# EasyEDA schematic RP2040.json
TITLE: RP2040 Minimal Design for JLCPCB; REV: 1.0; Date: 2023-03-28; Sheet: 1/1; Drawn By: Jeff Rebeiro; Company: ACustomArcade
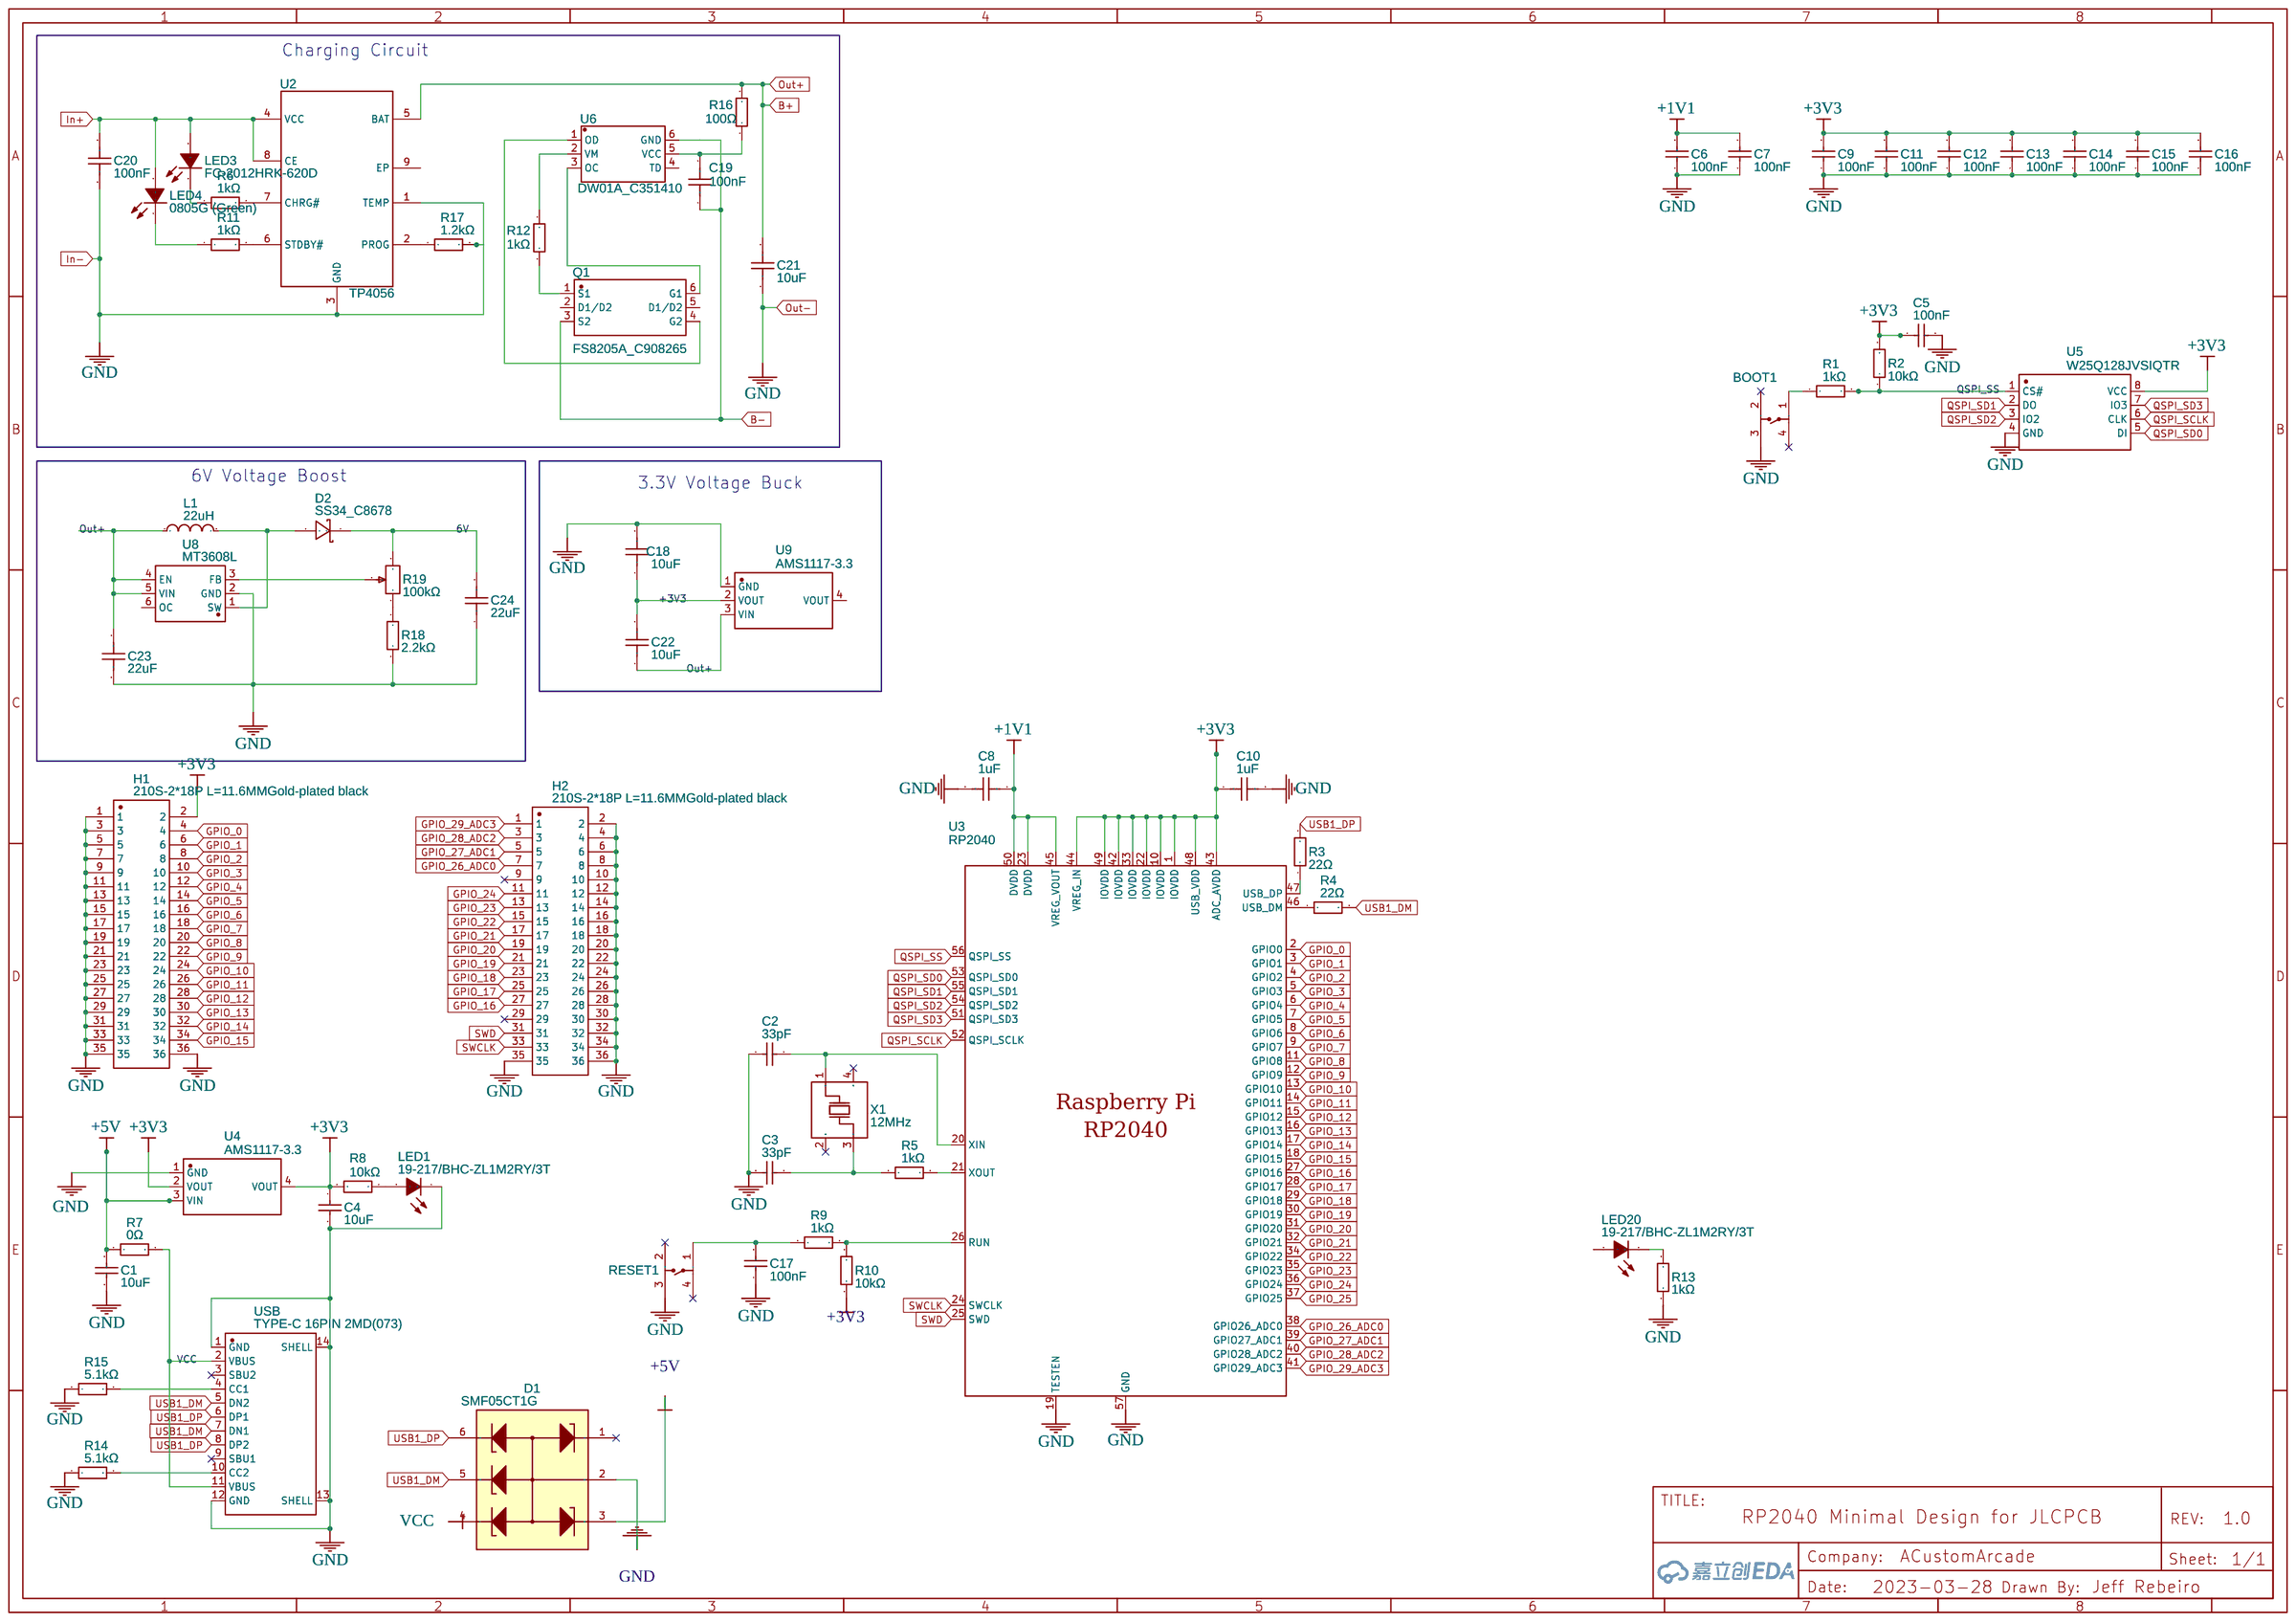
[diagram p0: schematic sheet]

## Parts
BOOT1  TD-1182SA-2.0H-250  [SW-SMD_4P-L3.5-W3.0-P1.50-LS4.6_DEALON_TD-1182SA-2.0H-250]
C1  10uF  [C1206]
C2  33pF  [C0402]
C3  33pF  [C0402]
C4  10uF  [C1206]
C5  100nF  [C0402_NEW]
C6  100nF  [C0402_NEW]
C7  100nF  [C0402_NEW]
C8  1uF  [C0402]
C9  100nF  [C0402_NEW]
C10  1uF  [C0402]
C11  100nF  [C0402_NEW]
C12  100nF  [C0402_NEW]
C13  100nF  [C0402_NEW]
C14  100nF  [C0402_NEW]
C15  100nF  [C0402_NEW]
C16  100nF  [C0402_NEW]
C17  100nF  [C0402_NEW]
C18  10uF  [C0603]
C19  100nF  [C0603]
C20  100nF  [C0603]
C21  10uF  [C0603]
C22  10uF  [C0603]
C23  22uF  [C0603]
C24  22uF  [C0603]
D1  SMF05CT1G  [SOT-363_L2.0-W1.3-P0.65-LS2.1-TL]
D2  SS34_C8678  [SMA_L4.3-W2.6-LS5.2-RD]
H1  210S-2*18P L=11.6MMGold-plated black  [HDR-TH_36P-P2.54-V-M-R2-C18-S2.54-1]
H2  210S-2*18P L=11.6MMGold-plated black  [HDR-TH_36P-P2.54-V-M-R2-C18-S2.54-1]
L1  22uH  [IND-SMD_L7.0-W6.8]
LED1  19-217/BHC-ZL1M2RY/3T  [LED0603-RD]
LED3  FC-2012HRK-620D  [LED0805-R-RD]
LED4  0805G (Green)  [LED0805-R-RD]
LED20  19-217/BHC-ZL1M2RY/3T  [LED0603-RD]
Q1  FS8205A_C908265  [SOT-23-6_L2.9-W1.6-P0.95-LS2.8-BR]
R1  1kΩ  [R0402]
R2  10kΩ  [R0402]
R3  22Ω  [R0402]
R4  22Ω  [R0402]
R5  1kΩ  [R0402]
R6  1kΩ  [R0805]
R7  0Ω  [R0603]
R8  10kΩ  [R0402]
R9  1kΩ  [R0402]
R10  10kΩ  [R0402]
R11  1kΩ  [R0805]
R12  1kΩ  [R0805]
R13  1kΩ  [R0402]
R14  5.1kΩ  [R0402]
R15  5.1kΩ  [R0402]
R16  100Ω  [R0805]
R17  1.2kΩ  [R0805]
R18  2.2kΩ  [R0805]
R19  100kΩ  [RES-ADJ-SMD_VG039NCH]
RESET1  TD-1182SA-2.0H-250  [SW-SMD_4P-L3.5-W3.0-P1.50-LS4.6_DEALON_TD-1182SA-2.0H-250]
U2  TP4056  [ESOP-8_L4.9-W3.9-P1.27-LS6.0-BL-EP]
U3  RP2040  [LQFN-56_L7.0-W7.0-P0.4-EP]
U4  AMS1117-3.3  [SOT-223-3_L6.5-W3.4-P2.30-LS7.0-BR]
U5  W25Q128JVSIQTR  [SOIC-8_L5.3-W5.3-P1.27-LS8.0-BL]
U6  DW01A_C351410  [SOT-23-6_L2.9-W1.6-P0.95-LS2.8-BL]
U8  MT3608L  [SOT-23-6_L2.9-W1.7-P0.95-LS2.8-BL]
U9  AMS1117-3.3  [SOT-223-3_L6.5-W3.4-P2.30-LS7.0-BR]
USB  TYPE-C 16PIN 2MD(073)  [USB-C-SMD_TYPE-C-6PIN-2MD-073]
X1  12MHz  [OSC-SMD_4P-L3.2-W2.5-BL]

## Library data of the parts
BOOT1 RESET1 = TD-1182SA-2.0H-250: Supplier: LCSC; Supplier Part: C2905178; Manufacturer: DEALON(德艺隆); Contributor: LCSC; JLCPCB Part Class: Extended Part
C1 C4 = CL31A106KBHNNNE: Supplier: LCSC; Manufacturer: SAMSUNG(三星); Supplier Part: C13585; JLCPCB Part Class: Basic Part
C2 C3 = 0402CG330J500NT: Supplier: LCSC; Manufacturer: FH(风华); Supplier Part: C1562; JLCPCB Part Class: Basic Part
C5-C7 C9 C11-C17 = CL05B104KO5NNNC: Supplier: LCSC; Manufacturer: SAMSUNG(三星); Supplier Part: C1525; JLCPCB Part Class: Basic Part
C8 C10 = CL05A105KA5NQNC: Supplier: LCSC; Manufacturer: SAMSUNG(三星); Supplier Part: C52923; JLCPCB Part Class: Basic Part
C18 C21 C22 = CL10A106KP8NNNC: Supplier: LCSC; Manufacturer: SAMSUNG(三星); Supplier Part: C19702; JLCPCB Part Class: Basic Part; link: https://lcsc.com/eda_search?q=C19702&%26type=1&ref=editor
C19 C20 = CC0603KRX7R9BB104: Supplier: LCSC; Manufacturer: YAGEO(国巨); Supplier Part: C14663; JLCPCB Part Class: Basic Part; link: https://lcsc.com/eda_search?q=C14663&%26type=1&ref=editor
C23 C24 = CL10A226MQ8NRNC: Supplier: LCSC; Manufacturer: SAMSUNG(三星); Supplier Part: C59461; JLCPCB Part Class: Basic Part; link: https://lcsc.com/eda_search?q=C59461&%26type=1&ref=editor
D1 = SMF05CT1G: Supplier: LCSC; Manufacturer: onsemi(安森美); Supplier Part: C15879; JLCPCB Part Class: Basic Part
D2 = SS34_C8678: Supplier: LCSC; Manufacturer Part: SS34; Manufacturer: MDD; Supplier Part: C8678; JLCPCB Part Class: Basic Part; link: https://lcsc.com/eda_search?q=C8678&%26type=1&ref=editor
H1 H2 = 210S-2*18P L=11.6MMGold-plated black: Supplier: LCSC; Supplier Part: C168945; Manufacturer: Ckmtw(灿科盟); Manufacturer Part: B-2100S36P-B110; Contributor: LCSC; JLCPCB Part Class: Extended Part
L1 = SMRH74-220MT: Supplier: LCSC; Manufacturer: SXN(顺翔诺); Supplier Part: C27442; JLCPCB Part Class: Extended Part; link: https://lcsc.com/eda_search?q=C27442&%26type=1&ref=editor
LED1 LED20 = 19-217/BHC-ZL1M2RY/3T: Supplier: LCSC; Manufacturer: EVERLIGHT(亿光); Supplier Part: C72041; JLCPCB Part Class: Basic Part
LED3 = FC-2012HRK-620D: Supplier: LCSC; Manufacturer: 国星光电; Manufacturer Part: NCD0805R1; Supplier Part: C84256; JLCPCB Part Class: Basic Part; link: https://lcsc.com/eda_search?q=C84256&%26type=1&ref=editor
LED4 = 0805G (Green): Supplier: LCSC; Manufacturer: KENTO; Manufacturer Part: KT-0805翠绿; Supplier Part: C2297; JLCPCB Part Class: Basic Part; link: https://lcsc.com/eda_search?q=C2297&%26type=1&ref=editor
Q1 = FS8205A_C908265: Contributor: LCSC; JLCPCB Part Class: Extended Part; Supplier: LCSC; Supplier Part: C908265; Manufacturer: FUXINSEMI(富芯森美); Manufacturer Part: FS8205A; link: https://lcsc.com/eda_search?q=C908265&%26type=1&ref=editor
R1 R5 R9 R13 = 0402WGF1001TCE: Supplier: LCSC; Manufacturer: UNI-ROYAL(厚声); Supplier Part: C11702; Resistance (Ohms): 1K; JLCPCB Part Class: Basic Part
R2 R8 R10 = 0402WGF1002TCE: Supplier: LCSC; Manufacturer: UNI-ROYAL(厚声); Supplier Part: C25744; Resistance (Ohms): 10K; JLCPCB Part Class: Basic Part
R3 R4 = 0402WGF220JTCE: Supplier: LCSC; Manufacturer: UNI-ROYAL(厚声); Supplier Part: C25092; Resistance (Ohms): 22; JLCPCB Part Class: Basic Part
R6 R11 R12 = 0805W8F1001T5E: Supplier: LCSC; Manufacturer: UNI-ROYAL(厚声); Supplier Part: C17513; JLCPCB Part Class: Basic Part; link: https://lcsc.com/eda_search?q=C17513&%26type=1&ref=editor
R7 = 0603WAF0000T5E: Supplier: LCSC; Manufacturer: UNI-ROYAL(厚声); Supplier Part: C21189; Resistance (Ohms): 0; JLCPCB Part Class: Basic Part
R14 R15 = 0402WGF5101TCE: Supplier: LCSC; Manufacturer: UNI-ROYAL(厚声); Supplier Part: C25905; Resistance (Ohms): 5.1K; JLCPCB Part Class: Basic Part
R16 = 0805W8F1000T5E: Supplier: LCSC; Manufacturer: UNI-ROYAL(厚声); Supplier Part: C17408; JLCPCB Part Class: Basic Part; link: https://lcsc.com/eda_search?q=C17408&%26type=1&ref=editor
R17 = 0805W8F1201T5E: Supplier: LCSC; Manufacturer: UNI-ROYAL(厚声); Supplier Part: C17379; JLCPCB Part Class: Basic Part; link: https://lcsc.com/eda_search?q=C17379&%26type=1&ref=editor
R18 = 0805W8F2201T5E: Supplier: LCSC; Manufacturer: UNI-ROYAL(厚声); Supplier Part: C17520; JLCPCB Part Class: Basic Part; link: https://lcsc.com/eda_search?q=C17520&%26type=1&ref=editor
R19 = VG039NCHXTB104: Contributor: LCSC; Resistance(Ohms): 100K; Supplier: LCSC; Manufacturer: HDK(北陆电气); Supplier Part: C128545; JLCPCB Part Class: Extended Part; link: https://lcsc.com/eda_search?q=C128545&%26type=1&ref=editor
U2 = TP4056: Contributor: Guest; Supplier: LCSC; Manufacturer: TOPPOWER(南京拓微); Manufacturer Part: TP4056-42-ESOP8; Supplier Part: C16581; JLCPCB Part Class: Basic Part; link: https://lcsc.com/eda_search?q=C16581&%26type=1&ref=editor
U3 = RP2040: Supplier: LCSC; Supplier Part: C2040; Manufacturer: Raspberry Pi(树莓派); JLCPCB Part Class: Extended Part; Contributor: LCSC
U4 U9 = AMS1117-3.3: sourceId: dwIGgezVh; Supplier: LCSC; Manufacturer: AMS; Supplier Part: C6186; JLCPCB Part Class: Basic Part
U5 = W25Q128JVSIQTR: Supplier: LCSC; Manufacturer: WINBOND(华邦); Manufacturer Part: W25Q128JVSIQ; Supplier Part: C97521; JLCPCB Part Class: Basic Part
U6 = DW01A_C351410: Contributor: LCSC; Supplier: LCSC; Supplier Part: C351410; Manufacturer: PUOLOP(迪浦); Manufacturer Part: DW01A; JLCPCB Part Class: Extended Part; link: https://lcsc.com/eda_search?q=C351410&%26type=1&ref=editor
U8 = MT3608L: Contributor: LCSC; Supplier: LCSC; Supplier Part: C2932326; Manufacturer: 西安航天民芯; JLCPCB Part Class: Extended Part; link: https://lcsc.com/eda_search?q=C2932326&%26type=1&ref=editor; Package Display: No
USB = TYPE-C 16PIN 2MD(073): Supplier: LCSC; Supplier Part: C2765186; Manufacturer: SHOU HAN(首韩); Contributor: LCSC; JLCPCB Part Class: Extended Part
X1 = X322512MSB4SI: Supplier: LCSC; Manufacturer: YXC; Supplier Part: C9002; JLCPCB Part Class: Basic Part

## Nets
6V: C24.2 D2.1(K) R19.3
+1V1: C6.2 C7.2 C8.1 U3.23(DVDD) U3.45(VREG_VOUT) U3.50(DVDD)
+3V3: C4.1 C5.2 C9.2 C10.1 C11.2 C12.2 C13.2 C14.2 C15.2 C16.2 C18.1 C22.2 H1.2 R2.2 R8.2 R10.1 U3.1(IOVDD) U3.10(IOVDD) U3.22(IOVDD) U3.33(IOVDD) U3.42(IOVDD) U3.43(ADC_AVDD) U3.44(VREG_IN) U3.48(USB_VDD) U3.49(IOVDD) U4.2(VOUT) U4.4(VOUT) U5.8(VCC) U9.2(VOUT)
+5V: C1.1 D1.3 R7.1 U4.3(VIN)
GND: BOOT1.3 C1.2 C2.1 C3.1 C4.2 C5.1 C6.1 C7.1 C8.2 C9.1 C10.2 C11.1 C12.1 C13.1 C14.1 C15.1 C16.1 C17.1 C18.2 C20.1 C21.1 C23.2 C24.1 D1.2 H1.1 H1.3 H1.5 H1.7 H1.9 H1.11 H1.13 H1.15 H1.17 H1.19 H1.21 H1.23 H1.25 H1.27 H1.29 H1.31 H1.33 H1.35 H1.36 H2.2 H2.4 H2.6 H2.8 H2.10 H2.12 H2.14 H2.16 H2.18 H2.20 H2.22 H2.24 H2.26 H2.28 H2.30 H2.32 H2.34 H2.35 H2.36 LED1.1(C) R13.1 R14.1 R15.1 R17.2 R18.2 RESET1.3 U2.1(TEMP) U2.3(GND) U3.19(TESTEN) U3.57(GND) U4.1(GND) U5.4(GND) U8.2(GND) U9.1(GND) USB.1(GND) USB.12(GND) USB.13(SHELL) USB.14(SHELL)
VCC: D1.4 R7.2 USB.2(VBUS) USB.11(VBUS)
B+: C21.2 C22.1 C23.1 L1.1 R16.2 U2.5(BAT) U8.4(EN) U8.5(VIN) U9.3(VIN)
B-: C19.1 Q1.3(S2) U6.6(GND)
GPIO_0: H1.4 U3.2(GPIO0)
GPIO_1: H1.6 U3.3(GPIO1)
GPIO_2: H1.8 U3.4(GPIO2)
GPIO_3: H1.10 U3.5(GPIO3)
GPIO_4: H1.12 U3.6(GPIO4)
GPIO_5: H1.14 U3.7(GPIO5)
GPIO_6: H1.16 U3.8(GPIO6)
GPIO_7: H1.18 U3.9(GPIO7)
GPIO_8: H1.20 U3.11(GPIO8)
GPIO_9: H1.22 U3.12(GPIO9)
GPIO_10: H1.24 U3.13(GPIO10)
GPIO_11: H1.26 U3.14(GPIO11)
GPIO_12: H1.28 U3.15(GPIO12)
GPIO_13: H1.30 U3.16(GPIO13)
GPIO_14: H1.32 U3.17(GPIO14)
GPIO_15: H1.34 U3.18(GPIO15)
GPIO_16: H2.27 U3.27(GPIO16)
GPIO_17: H2.25 U3.28(GPIO17)
GPIO_18: H2.23 U3.29(GPIO18)
GPIO_19: H2.21 U3.30(GPIO19)
GPIO_20: H2.19 U3.31(GPIO20)
GPIO_21: H2.17 U3.32(GPIO21)
GPIO_22: H2.15 U3.34(GPIO22)
GPIO_23: H2.13 U3.35(GPIO23)
GPIO_24: H2.11 U3.36(GPIO24)
GPIO_25: U3.37(GPIO25)
GPIO_26_ADC0: H2.7 U3.38(GPIO26_ADC0)
GPIO_27_ADC1: H2.5 U3.39(GPIO27_ADC1)
GPIO_28_ADC2: H2.3 U3.40(GPIO28_ADC2)
GPIO_29_ADC3: H2.1 U3.41(GPIO29_ADC3)
In+: C20.2 LED3.1(+) LED4.1(A) U2.4(VCC) U2.8(CE)
QSPI_SCLK: U3.52(QSPI_SCLK) U5.6(CLK)
QSPI_SD0: U3.53(QSPI_SD0) U5.5(DI)
QSPI_SD1: U3.55(QSPI_SD1) U5.2(DO)
QSPI_SD2: U3.54(QSPI_SD2) U5.3(IO2)
QSPI_SD3: U3.51(QSPI_SD3) U5.7(IO3)
QSPI_SS: R1.2 R2.1 U3.56(QSPI_SS) U5.1(CS#)
SWCLK: H2.33 U3.24(SWCLK)
SWD: H2.31 U3.25(SWD)
USB1_DM: D1.5 R4.2 USB.5(DN2) USB.7(DN1)
USB1_DP: D1.6 R3.2 USB.6(DP1) USB.8(DP2)
Net-(BOOT1-1): BOOT1.1 R1.1
Net-(C2-2): C2.2 U3.20(XIN) X1.1(OSC1)
Net-(C3-2): C3.2 R5.1 X1.3(OSC2)
Net-(C17-2): C17.2 R9.1 RESET1.1
Net-(C19-2): C19.2 R16.1 U6.5(VCC)
Net-(D2-2): D2.2(A) L1.2 U8.1(SW)
Net-(LED1-2): LED1.2(A) R8.1
Net-(LED3-2): LED3.2(-) R6.1
Net-(LED4-2): LED4.2(K) R11.1
Net-(LED20-1): LED20.1(C) R13.2
Net-(Q1-1): Q1.1(S1) R12.2
Net-(Q1-4): Q1.4(G2) U6.1(OD)
Net-(Q1-6): Q1.6(G1) U6.3(OC)
Net-(R3-1): R3.1 U3.47(USB_DP)
Net-(R4-1): R4.1 U3.46(USB_DM)
Net-(R5-2): R5.2 U3.21(XOUT)
Net-(R6-2): R6.2 U2.7(CHRG#)
Net-(R9-2): R9.2 R10.2 U3.26(RUN)
Net-(R11-2): R11.2 U2.6(STDBY#)
Net-(R12-1): R12.1 U6.2(VM)
Net-(R14-2): R14.2 USB.10(CC2)
Net-(R15-2): R15.2 USB.4(CC1)
Net-(R17-1): R17.1 U2.2(PROG)
Net-(R18-1): R18.1 R19.1
Net-(R19-2): R19.2 U8.3(FB)

Not connected (* = marked no-connect by the designer): BOOT1 2* 4*; D1 1*; H2 9* 29*; LED20 2(A); Q1 2(D1/D2) 5(D1/D2); RESET1 2* 4*; U2 9(EP); U6 4(TD); U8 6(OC); U9 4(VOUT); USB 3(SBU2)* 9(SBU1)*; X1 2(GND)* 4(GND)*

## Notes on the sheet
- Charging Circuit
- 6V Voltage Boost
- 3.3V Voltage Buck
